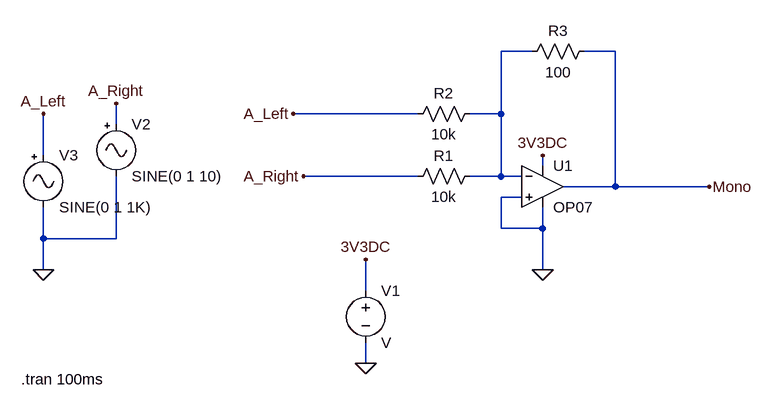
[diagram p0: schematic Stereo_To_Mono.asc]
Stereo_To_Mono.asc, the LTspice schematic file:
Version 4
SHEET 1 880 688
WIRE 352 48 304 48
WIRE 480 48 432 48
WIRE 176 144 -16 144
WIRE 304 144 304 48
WIRE 304 144 256 144
WIRE -288 160 -288 128
WIRE -400 208 -400 144
WIRE 368 224 368 208
WIRE 176 240 0 240
WIRE 304 240 304 144
WIRE 304 240 256 240
WIRE 336 240 304 240
WIRE 480 256 480 48
WIRE 480 256 400 256
WIRE 624 256 480 256
WIRE 336 272 304 272
WIRE 304 320 304 272
WIRE 368 320 368 288
WIRE 368 320 304 320
WIRE -400 336 -400 288
WIRE -288 336 -288 240
WIRE -288 336 -400 336
WIRE -400 384 -400 336
WIRE 368 384 368 320
WIRE 96 416 96 368
WIRE 96 528 96 496
FLAG 96 528 0
FLAG 368 384 0
FLAG 96 368 3V3DC
FLAG 368 208 3V3DC
FLAG -16 144 A_Left
FLAG 0 240 A_Right
FLAG 624 256 Mono
FLAG -400 384 0
FLAG -400 144 A_Left
FLAG -288 128 A_Right
SYMBOL Opamps\\OP07 368 192 R0
SYMATTR InstName U1
SYMBOL res 272 224 R90
WINDOW 0 0 56 VBottom 2
WINDOW 3 32 56 VTop 2
SYMATTR InstName R1
SYMATTR Value 10k
SYMBOL res 272 128 R90
WINDOW 0 0 56 VBottom 2
WINDOW 3 32 56 VTop 2
SYMATTR InstName R2
SYMATTR Value 10k
SYMBOL res 448 32 R90
WINDOW 0 0 56 VBottom 2
WINDOW 3 32 56 VTop 2
SYMATTR InstName R3
SYMATTR Value 100
SYMBOL voltage 96 400 R0
SYMATTR InstName V1
SYMBOL Misc\\signal -288 144 R0
WINDOW 123 0 0 Left 0
WINDOW 39 0 0 Left 0
SYMATTR InstName V2
SYMATTR Value SINE(0 1 10)
SYMBOL Misc\\signal -400 192 R0
WINDOW 123 0 0 Left 0
WINDOW 39 0 0 Left 0
SYMATTR InstName V3
TEXT -434 552 Left 2 !.tran 100ms

The netlist it stands for:
* Stereo_To_Mono.asc
XU1 0 N001 3V3DC 0 Mono LT1001  ; OP07, pins In+ In- V+ V- OUT
R1 N001 A_Right 10k
R2 N001 A_Left 10k
R3 Mono N001 100
V1 3V3DC 0 V
V2 A_Right 0 SINE(0 1 10)
V3 A_Left 0 SINE(0 1 1K)
.tran 100ms
.lib LTC.lib
.backanno
.end